# EAGLE schematic Ell-i-proto (EAGLE 6.4)

## Sheet 1 of 3: POE
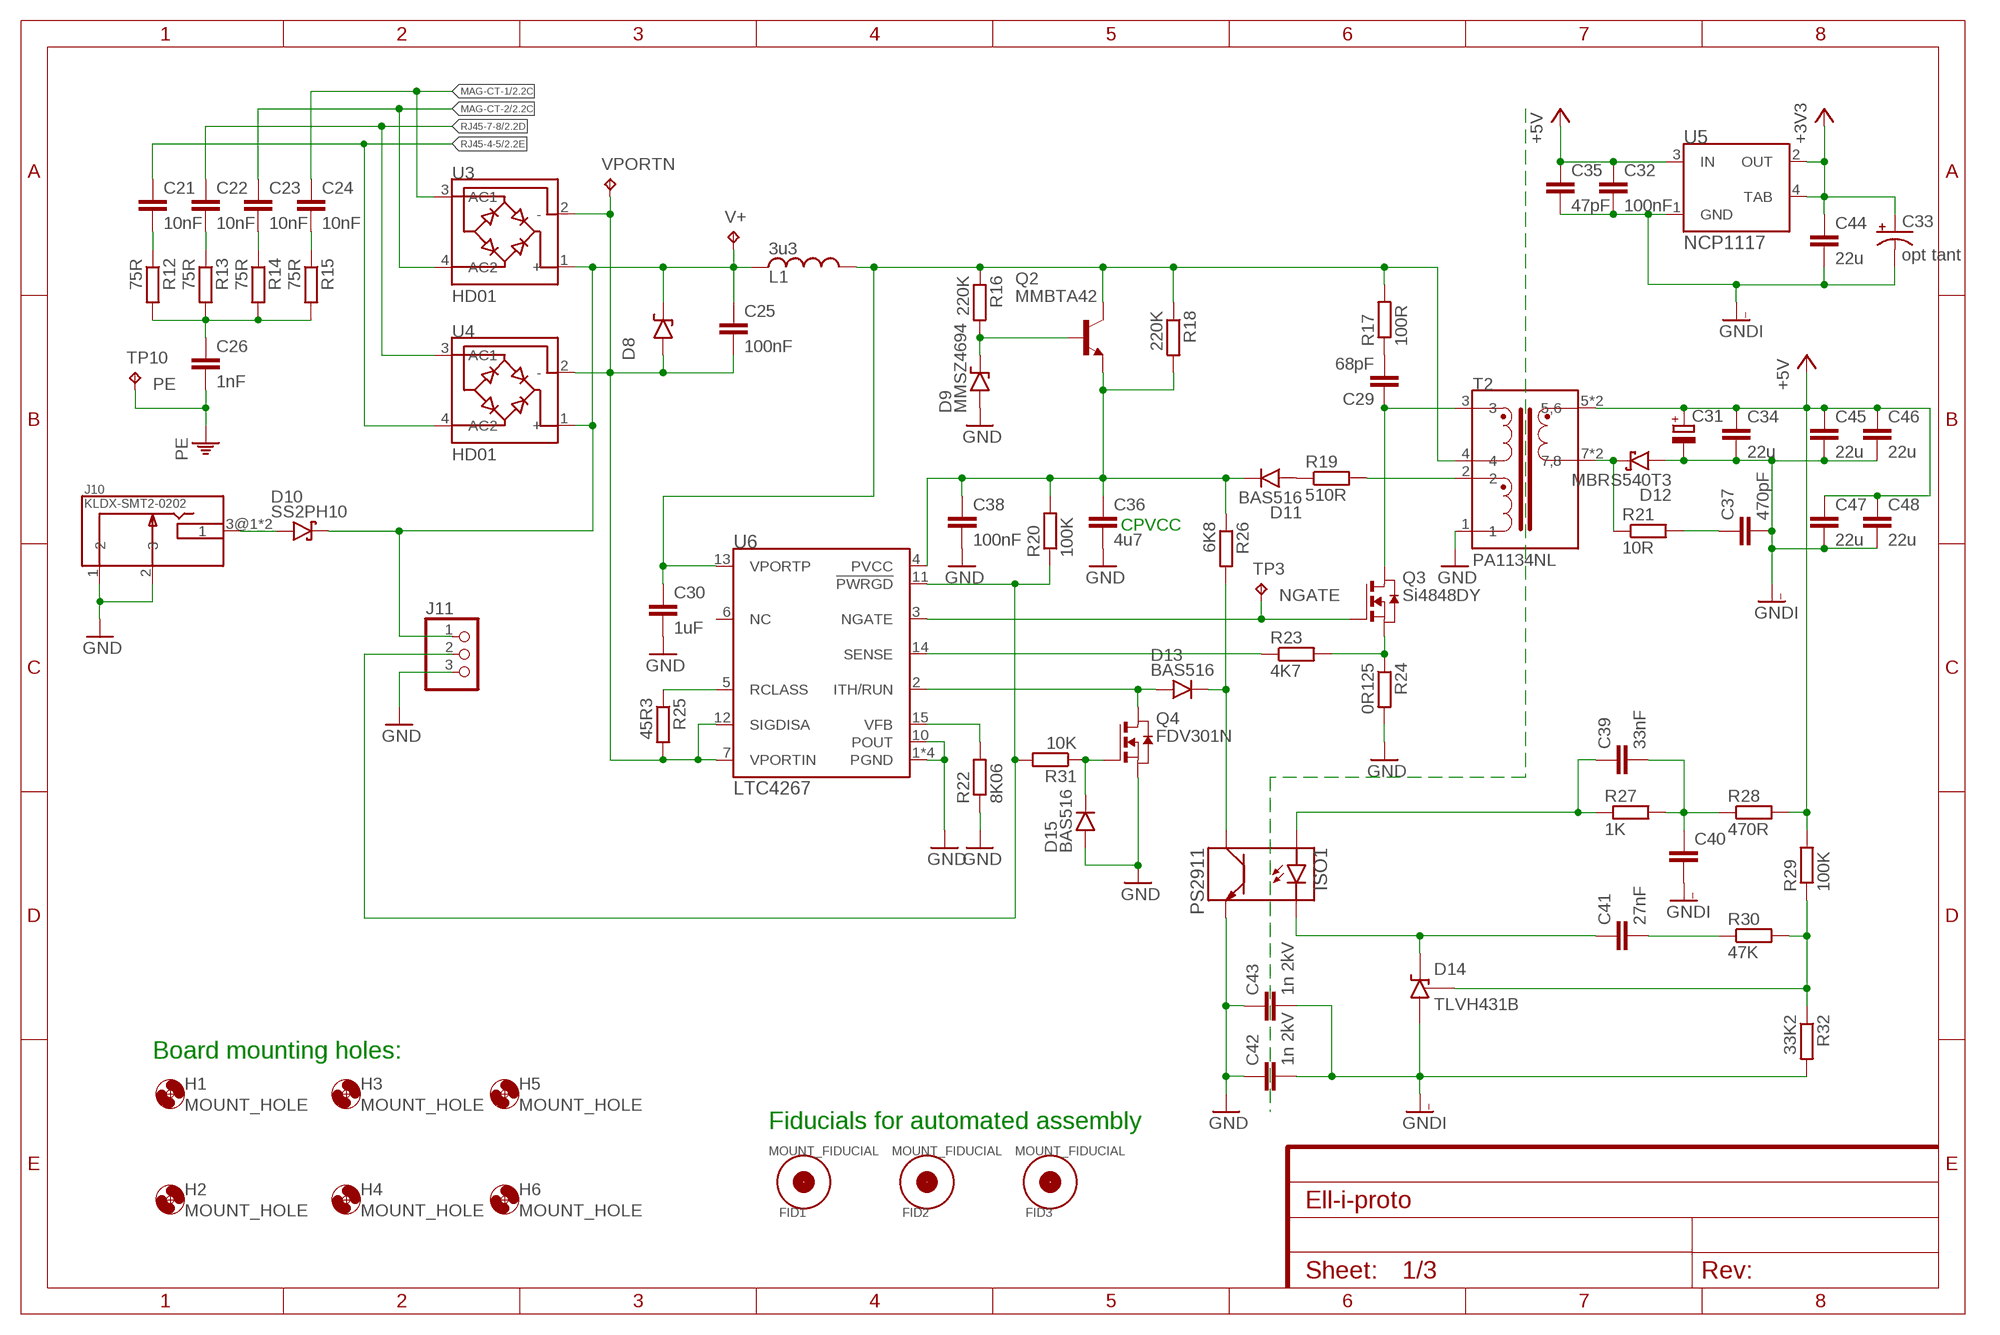
[diagram p0: schematic, sheet 1]

### Parts
C21  10nF  C0603  [0603]
C22  10nF  C0603  [0603]
C23  10nF  C0603  [0603]
C24  10nF  C0603  [0603]
C25  100nF  C0805  [0805]
C26  1nF  C-EUC1206  [C1206]
C29  68pF  C0805  [0805]
C30  1uF  C0805  [0805]
C31  CPOL-EU153CLV-0605  [153CLV-0605]
C32  100nF  C0402  [0402]
C33  opt tant  CPOL-USCT3216  [CT3216]
C34  22u  C0805  [0805]
C35  47pF  C0402  [0402]
C36  4u7  C0805  [0805]
C37  470pF  C0402  [0402]
C38  100nF  C0402  [0402]
C39  33nF  C0402  [0402]
C40  C0402  [0402]
C41  27nF  C0402  [0402]
C42  1n 2kV  C-EUC1206  [C1206]
C43  1n 2kV  C-EUC1206  [C1206]
C44  22u  C0805  [0805]
C45  22u  C0805  [0805]
C46  22u  C0805  [0805]
C47  22u  C0805  [0805]
C48  22u  C0805  [0805]
D8  SMAJ58A  [SMA]
D9  MMSZ4694  ZENER-SOD323-123  [SOD-123]
D10  SS2PH10  [SMP]
D11  BAS516  [SOD523]
D12  MBRS540T3  [SMC]
D13  BAS516  [SOD523]
D14  TLVH431B  TLV431A  [SOT23]
D15  BAS516  [SOD523]
FID1  MOUNT_FIDUCIAL  [MOUNT_FIDUCIAL]
FID2  MOUNT_FIDUCIAL  [MOUNT_FIDUCIAL]
FID3  MOUNT_FIDUCIAL  [MOUNT_FIDUCIAL]
H1  MOUNT_HOLE  [MOUNT_HOLE]
H2  MOUNT_HOLE  [MOUNT_HOLE]
H3  MOUNT_HOLE  [MOUNT_HOLE]
H4  MOUNT_HOLE  [MOUNT_HOLE]
H5  MOUNT_HOLE  [MOUNT_HOLE]
H6  MOUNT_HOLE  [MOUNT_HOLE]
ISO1  PS2911  PS2911-1  [PS2911]
J10  KLDX-SMT2-0202  [KLDX-SMT2-0202]
J11  PINHD-1X3  [1X03]
L1  3u3  MSS5121  [MSS5121]
Q2  MMBTA42  BC846ALT1SMD  [SOT23]
Q3  Si4848DY  SI4848DY  [SO8]
Q4  FDV301N  [SOT23]
R12  75R  R0603  [0603]
R13  75R  R0603  [0603]
R14  75R  R0603  [0603]
R15  75R  R0603  [0603]
R16  220K  R0402  [0402]
R17  100R  R0805  [0805]
R18  220K  R0402  [0402]
R19  510R  R0402  [0402]
R20  100K  R0402  [0402]
R21  10R  R0402  [0402]
R22  8K06  R0402  [0402]
R23  4K7  R0402  [0402]
R24  0R125  R-EU_R1206  [R1206]
R25  45R3  R0402  [0402]
R26  6K8  R0402  [0402]
R27  1K  R0402  [0402]
R28  470R  R0402  [0402]
R29  100K  R0402  [0402]
R30  47K  R0402  [0402]
R31  10K  R0402  [0402]
R32  33K2  R0402  [0402]
T2  PA1134NL  [PA1134NL]
TP3  TPB1,27  [B1,27]
TP10  TPB1,27  [B1,27]
U3  HD01  [MINIDIP4]
U4  HD01  [MINIDIP4]
U5  NCP1117  [SOT223]
U6  LTC4267  LTC4267IGN  [SSOP16]
V+  TPB1,27  [B1,27]
VPORTN  TPB1,27  [B1,27]

### Nets
+3V3 [power]: C33.+ C44.1 U5.2(OUT) U5.4(TAB) ; also sheet 2,3
+5V [power]: C31.+ C32.1 C34.1 C35.1 C45.1 C46.1 C47.1 C48.1 R28.2 R29.2 T2.5(5,6) T2.6(5,6) U5.3(IN) ; also sheet 3
GND [power]: C30.2 C36.2 C38.2 C42.1 C43.1 D9.A D15.2(A) ISO1.3 J10.1 J10.2 J11.3 Q4.2(S) R22.1 R24.2 T2.1 U6.1(PGND) U6.8(PGND) U6.9(PGND) U6.10(POUT) U6.16(PGND)
GNDI [power]: C31.- C32.2 C33.- C34.2 C35.2 C37.2 C40.2 C42.2 C43.2 C44.2 C45.2 C46.2 C47.2 C48.2 D12.2(A) D14.3(A) R32.2 U5.1(GND) ; also sheet 2,3
MAG-CT-1 [power]: C24.1 U3.3(AC1) ; also sheet 2
MAG-CT-2 [power]: C23.1 U3.4(AC2) ; also sheet 2
N22741 [power]: C21.2 R12.1
N22792 [power]: C22.2 R13.1
N22914 [power]: C26.1 R12.2 R13.2 R14.2 R15.2
N23144 [power]: C23.2 R14.1
N23171 [power]: C24.2 R15.1
N27571 [high_voltage]: C29.1 Q3.P$5(D) Q3.P$6(D) Q3.P$7(D) Q3.P$8(D) T2.3
N27735 [high_voltage]: Q3.P$1(S) Q3.P$2(S) Q3.P$3(S) R23.2 R24.1
N28455: R23.1 U6.14(SENSE)
N30165: C36.1 C38.1 D11.1(C) Q2.2(E) R18.2 R20.2 R26.1 U6.4(PVCC)
N30229: D11.2(A) R19.1
N30416: D13.2(A) Q4.3(D) U6.2(ITH/RUN)
N32035: D15.1(C) Q4.1(G) R31.1
N36998: R22.2 U6.15(VFB)
N40108: D14.1(REF) R29.1 R30.2 R32.1
N40137: C41.1 D14.2(C) ISO1.2
N40177: C39.1 ISO1.1 R27.1
N40361: D12.1(C) R21.1 T2.7(7,8) T2.8(7,8)
N40778: C37.1 R21.2
N62909 [power]: C30.1 L1.2 Q2.3(C) R16.1 R17.2 R18.1 T2.4 U6.13(VPORTP)
N62998: D9.C Q2.1(B) R16.2
N64947: R25.1 U6.5(RCLASS)
N68062 [power]: R19.2 T2.2
N68837: C29.2 R17.1
N69576: D13.1(C) ISO1.4 R26.2
N69902: C41.2 R30.1
N70322: C39.2 C40.1 R27.2 R28.1
N184903 [high_power]: D10.A J10.3@1 J10.3@2
NGATE: Q3.P$4(G) TP3.TP U6.3(NGATE)
NPWRGD: J11.2 R20.1 R31.2 U6.11(!PWRGD)
PE [high_voltage]: C26.2 TP10.TP ; also sheet 2
RJ45-4-5 [power]: C21.1 U4.4(AC2) ; also sheet 2
RJ45-7-8 [power]: C22.1 U4.3(AC1) ; also sheet 2
V+ [high_power]: C25.1 D8.1(C) D10.C J11.1 L1.1 U3.1(+) U4.1(+) V+.TP
VPORTN [high_power]: C25.2 D8.2(A) R25.2 U3.2(-) U4.2(-) U6.7(VPORTIN) U6.12(SIGDISA) VPORTN.TP
Unconnected: U6.6(NC)

### Notes on the sheet
- CPVCC
- Board mounting holes:
- Fiducials for automated assembly

## Sheet 2 of 3: Ethernet
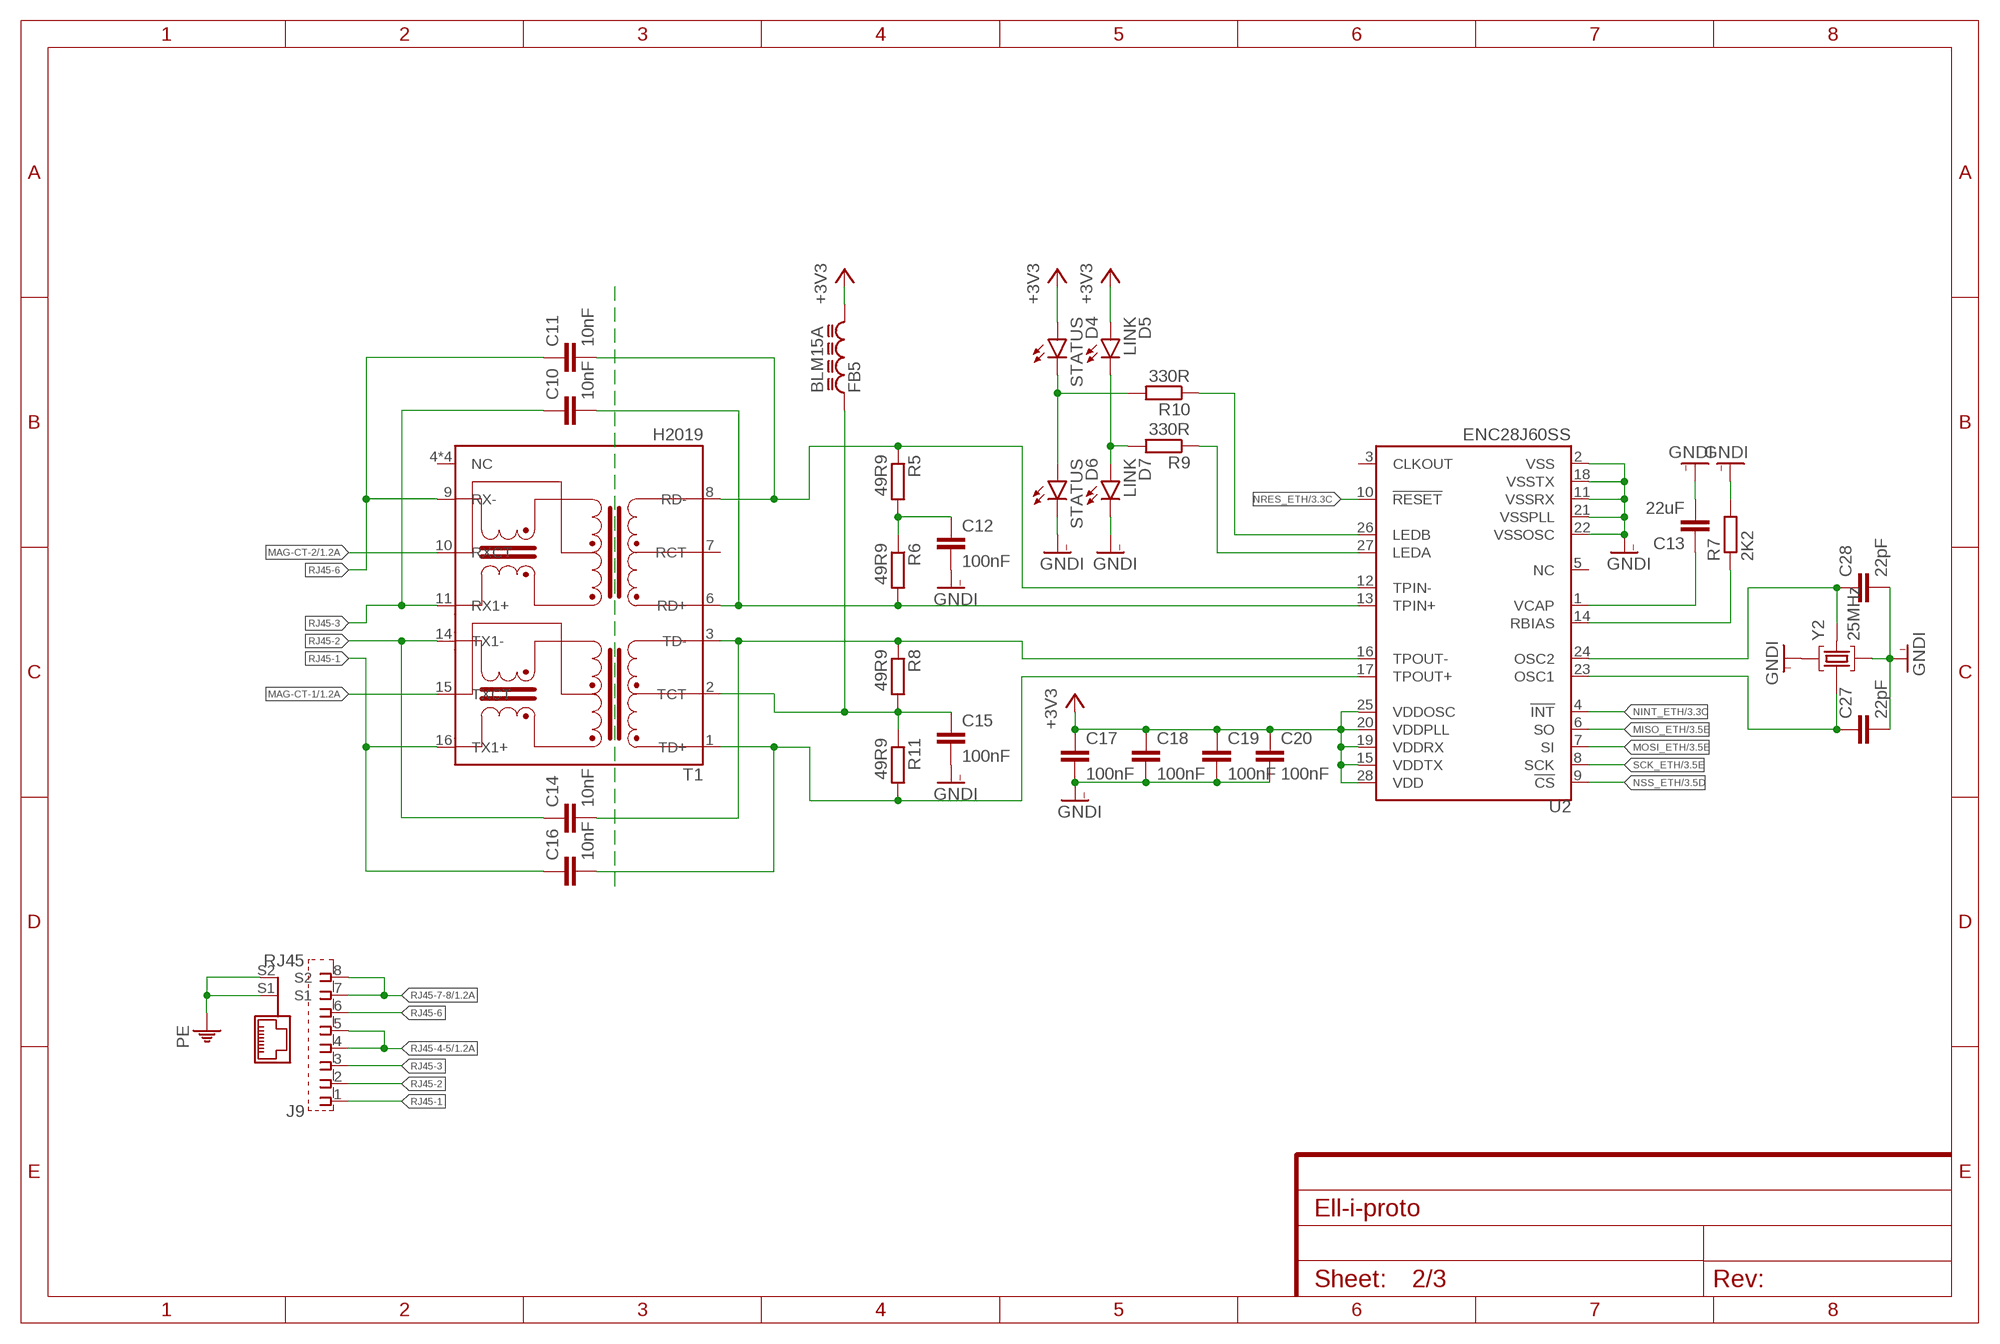
[diagram p1: schematic, sheet 2]

### Parts
C10  10nF  C-EUC1206  [C1206]
C11  10nF  C-EUC1206  [C1206]
C12  100nF  C0402  [0402]
C13  22uF  C0805  [0805]
C14  10nF  C-EUC1206  [C1206]
C15  100nF  C0402  [0402]
C16  10nF  C-EUC1206  [C1206]
C17  100nF  C0402  [0402]
C18  100nF  C0402  [0402]
C19  100nF  C0402  [0402]
C20  100nF  C0402  [0402]
C27  22pF  C0402  [0402]
C28  22pF  C0402  [0402]
D4  STATUS  LED0603  [DIODE0603]
D5  LINK  LED0603  [DIODE0603]
D6  STATUS  LED0603  [DIODE0603]
D7  LINK  LED0603  [DIODE0603]
FB5  BLM15A  LQM15  [0402]
J9  RJ45  85502-5008  [85502-5008]
R5  49R9  R0402  [0402]
R6  49R9  R0402  [0402]
R7  2K2  R0402  [0402]
R8  49R9  R0402  [0402]
R9  330R  R0402  [0402]
R10  330R  R0402  [0402]
R11  49R9  R0402  [0402]
T1  H2019  H2019NL  [H2019NL]
U2  ENC28J60SS  ENC28J60  [SSOP28DB]
Y2  25MHz  XTAL3225  [XTAL3225]

### Nets
+3V3 [power]: C17.1 C18.1 C19.1 C20.1 D4.2(A) D5.2(A) FB5.2 U2.15(VDDTX) U2.19(VDDRX) U2.20(VDDPLL) U2.25(VDDOSC) U2.28(VDD) ; also sheet 1,3
GNDI [power]: C12.2 C13.2 C15.2 C17.2 C18.2 C19.2 C20.2 C27.2 C28.2 D6.1(C) D7.1(C) R7.2 U2.2(VSS) U2.11(VSSRX) U2.18(VSSTX) U2.21(VSSPLL) U2.22(VSSOSC) Y2.2(GND) Y2.4(GND) ; also sheet 1,3
MAG-CT-1 [power]: T1.15(TXCT) ; also sheet 1
MAG-CT-2 [power]: T1.10(RXCT) ; also sheet 1
MISO_ETH: U2.6(SO) ; also sheet 3
MOSI_ETH: U2.7(SI) ; also sheet 3
N08557: C14.2 R8.1 T1.3(TD-) U2.16(TPOUT-)
N08738: C16.2 R11.2 T1.1(TD+) U2.17(TPOUT+)
N08782: C10.2 R6.2 T1.6(RD+) U2.13(TPIN+)
N08928: C11.2 R5.1 T1.8(RD-) U2.12(TPIN-)
N12266: C15.1 FB5.1 R8.2 R11.1 T1.2(TCT)
N12583: R7.1 U2.14(RBIAS)
N13468: C28.1 U2.24(OSC2) Y2.3(C2)
N13660: C27.1 U2.23(OSC1) Y2.1(C1)
N14101: C13.1 U2.1(VCAP)
N16078: C12.1 R5.2 R6.1
N181699: R9.1 U2.27(LEDA)
N181770: R10.1 U2.26(LEDB)
N182309: D4.1(C) D6.2(A) R10.2
N$1: D5.1(C) D7.2(A) R9.2
NINT_ETH: U2.4(!INT) ; also sheet 3
NRES_ETH: U2.10(!RESET) ; also sheet 3
NSS_ETH: U2.9(!CS) ; also sheet 3
PE [high_voltage]: J9.S1 J9.S2 ; also sheet 1
RJ45-1: C16.1 J9.1 T1.16(TX1+)
RJ45-2: C14.1 J9.2 T1.14(TX1-)
RJ45-3: C10.1 J9.3 T1.11(RX1+)
RJ45-4-5 [power]: J9.4 J9.5 ; also sheet 1
RJ45-6: C11.1 J9.6 T1.9(RX-)
RJ45-7-8 [power]: J9.7 J9.8 ; also sheet 1
SCK_ETH: U2.8(SCK) ; also sheet 3
Unconnected: T1.4(NC) T1.5(NC) T1.7(RCT) T1.12(NC) T1.13(NC) U2.3(CLKOUT) U2.5(NC)

## Sheet 3 of 3: CPU
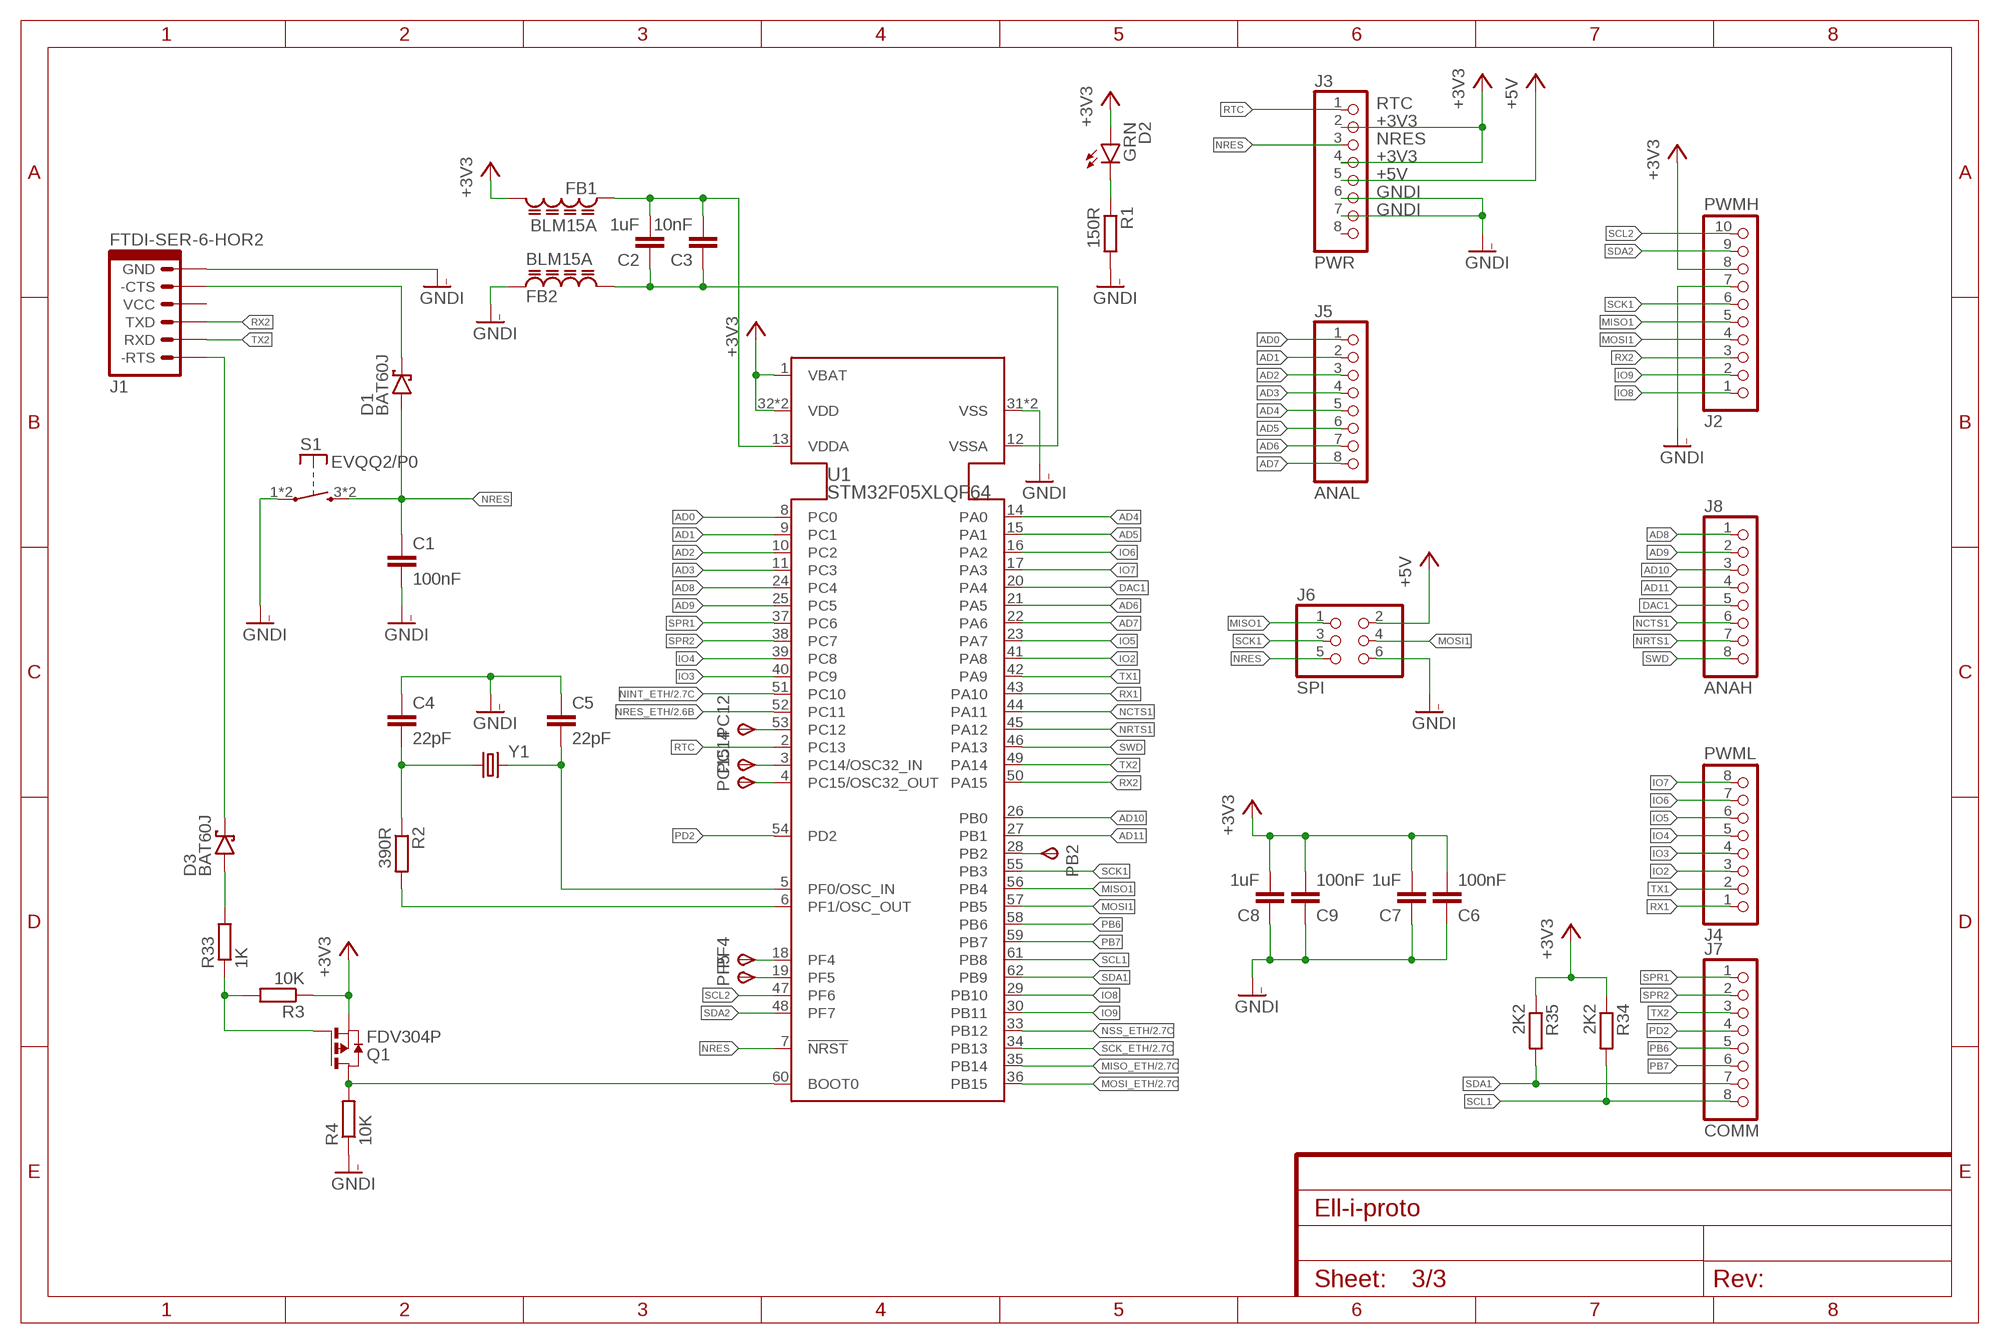
[diagram p2: schematic, sheet 3]

### Parts
C1  100nF  C0402  [0402]
C2  1uF  C0402  [0402]
C3  10nF  C0402  [0402]
C4  22pF  C0402  [0402]
C5  22pF  C0402  [0402]
C6  100nF  C0402  [0402]
C7  1uF  C0402  [0402]
C8  1uF  C0402  [0402]
C9  100nF  C0402  [0402]
D1  BAT60J  [SOD323_DIODE]
D2  GRN  LED0603  [DIODE0603]
D3  BAT60J  [SOD323_DIODE]
FB1  BLM15A  LQM15  [0402]
FB2  BLM15A  LQM15  [0402]
J1  FTDI-SER-6-HOR2  [TSM-106-01-L-SH-REV]
J2  PWMH  PINHD-1X10  [1X10]
J3  PWR  PINHD-1X8  [1X08]
J4  PWML  PINHD-1X8  [1X08]
J5  ANAL  PINHD-1X8  [1X08]
J6  SPI  PINHD-2X3  [2X03]
J7  COMM  PINHD-1X8  [1X08]
J8  ANAH  PINHD-1X8  [1X08]
PB2  TPSB1,27  [B1,27]
PC12  TPSB1,27  [B1,27]
PC14  TPSB1,27  [B1,27]
PC15  TPSB1,27  [B1,27]
PF4  TPSB1,27  [B1,27]
PF5  TPSB1,27  [B1,27]
Q1  FDV304P  [SOT23]
R1  150R  R0402  [0402]
R2  390R  R0402  [0402]
R3  10K  R0402  [0402]
R4  10K  R0402  [0402]
R33  1K  R0402  [0402]
R34  2K2  R0402  [0402]
R35  2K2  R0402  [0402]
S1  EVQQ2/P0  [EVQQ2/P0]
U1  STM32F05XLQF64  STM32F051RX  [LQFP64]
Y1  CRYSTALSM49  [SM49]

### Nets
+3V3 [power]: C6.2 C7.2 C8.2 C9.2 D2.2(A) FB1.2 J2.8 J3.2 J3.4 Q1.2(S) R3.1 R34.1 R35.1 U1.1(VBAT) U1.32(VDD) U1.64(VDD) ; also sheet 1,2
+5V [power]: J3.5 J6.2 ; also sheet 1
AD0: J5.1 U1.8(PC0)
AD1: J5.2 U1.9(PC1)
AD2: J5.3 U1.10(PC2)
AD3: J5.4 U1.11(PC3)
AD4: J5.5 U1.14(PA0)
AD5: J5.6 U1.15(PA1)
AD6: J5.7 U1.21(PA5)
AD7: J5.8 U1.22(PA6)
AD8: J8.1 U1.24(PC4)
AD9: J8.2 U1.25(PC5)
AD10: J8.3 U1.26(PB0)
AD11: J8.4 U1.27(PB1)
DAC1: J8.5 U1.20(PA4)
GNDI [power]: C1.2 C4.1 C5.1 C6.1 C7.1 C8.1 C9.1 FB2.1 J1.1(GND) J2.7 J3.6 J3.7 J6.6 R1.2 R4.1 S1.1(P) S1.2(P) U1.31(VSS) U1.63(VSS) ; also sheet 1,2
IO2: J4.3 U1.41(PA8)
IO3: J4.4 U1.40(PC9)
IO4: J4.5 U1.39(PC8)
IO5: J4.6 U1.23(PA7)
IO6: J4.7 U1.16(PA2)
IO7: J4.8 U1.17(PA3)
IO8: J2.1 U1.29(PB10)
IO9: J2.2 U1.30(PB11)
MISO1: J2.5 J6.1 U1.56(PB4)
MISO_ETH: U1.35(PB14) ; also sheet 2
MOSI1: J2.4 J6.4 U1.57(PB5)
MOSI_ETH: U1.36(PB15) ; also sheet 2
N41567: D2.1(C) R1.1
N98218: C2.1 C3.1 FB2.2 U1.12(VSSA)
N100630: C2.2 C3.2 FB1.1 U1.13(VDDA)
N118561: Q1.3(D) R4.2 U1.60(BOOT0)
N205481: C4.2 R2.1 Y1.1
N209164: Q1.1(G) R3.2 R33.1
N230488: D3.2(A) R33.2
N$2: PC14.TP(PP) U1.3(PC14/OSC32_IN)
N$3: PC15.TP(PP) U1.4(PC15/OSC32_OUT)
N$5: PF4.TP(PP) U1.18(PF4)
N$6: D1.1(C) J1.2(-CTS)
N$7: PF5.TP(PP) U1.19(PF5)
N$8: PB2.TP(PP) U1.28(PB2)
N$9: PC12.TP(PP) U1.53(PC12)
NCTS1: J8.6 U1.44(PA11)
NDSR2: D3.1(C) J1.6(-RTS)
NINT_ETH: U1.51(PC10) ; also sheet 2
NRES: C1.1 D1.2(A) J3.3 J6.5 S1.3(S) S1.4(S) U1.7(!NRST)
NRES_ETH: U1.52(PC11) ; also sheet 2
NRTS1: J8.7 U1.45(PA12)
NSS_ETH: U1.33(PB12) ; also sheet 2
PB6: J7.5 U1.58(PB6)
PB7: J7.6 U1.59(PB7)
PD2: J7.4 U1.54(PD2)
PF0: C5.2 U1.5(PF0/OSC_IN) Y1.2
PF1: R2.2 U1.6(PF1/OSC_OUT)
RTC: J3.1 U1.2(PC13)
RX1: J4.1 U1.43(PA10)
RX2: J1.4(TXD) J2.3 U1.50(PA15)
SCK1: J2.6 J6.3 U1.55(PB3)
SCK_ETH: U1.34(PB13) ; also sheet 2
SCL1: J7.8 R34.2 U1.61(PB8)
SCL2: J2.10 U1.47(PF6)
SDA1: J7.7 R35.2 U1.62(PB9)
SDA2: J2.9 U1.48(PF7)
SPR1: J7.1 U1.37(PC6)
SPR2: J7.2 U1.38(PC7)
SWD: J8.8 U1.46(PA13)
TX1: J4.2 U1.42(PA9)
TX2: J1.5(RXD) J7.3 U1.49(PA14)
Unconnected: J1.3(VCC) J3.8

## Library data of the parts
C1-C9 C12 C13 C15 C17-C25 C27-C30 C32 C34-C41 C44-C48 = ell-i:C
C10 C11 C14 C16 C26 C42 C43 = rcl:C-EU: CAPACITOR, European symbol
C31 = rcl:CPOL-EU: POLARIZED CAPACITOR, European symbol
C33 = rcl:CPOL-US: POLARIZED CAPACITOR, American symbol
D1 D3 = ell-i:BAT60J
D2 D4-D7 = ell-i:LED0603
D8 = ell-i:SMAJ58A
D9 = ell-i:ZENER-SOD323
D10 = ell-i:SS2PH10
D11 D13 D15 = ell-i:BAS516
D12 = ell-i:MBRS540T3
D14 = ell-i:TLV431A
FB1 FB2 FB5 = ell-i:LQM15
FID1-FID3 = ell-i:MOUNT_FIDUCIAL
H1-H6 = ell-i:MOUNT_HOLE
ISO1 = ell-i:PS2911-1
J1 = ell-i:FTDI-SER-6
J2 = ell-i:PINHD-1X10: PIN HEADER
J3-J5 J7 J8 = ell-i:PINHD-1X8: PIN HEADER
J6 = ell-i:PINHD-2X3: PIN HEADER
J9 = ell-i:85502-5008
J10 = ell-i:KLDX-SMT2-0202
J11 = pinhead:PINHD-1X3: PIN HEADER
L1 = ell-i:MSS5121
PB2 PC12 PC14 PC15 PF4 PF5 = testpad:TPS: TEST PIN
Q1 = ell-i:FDV304P
Q2 = transistor-npn:BC846*: NPN Transistor
Q3 = ell-i:SI4848DY
Q4 = ell-i:FDV301N
R1-R23 R25-R35 = ell-i:R
R24 = rcl:R-EU_: RESISTOR, European symbol
S1 = ell-i:EVQQ2/P0
T1 = ell-i:H2019NL
T2 = ell-i:PA1134NL
TP3 TP10 V+ VPORTN = testpad:TP: Test pad
U1 = ell-i:STM32F051RX
U2 = ell-i:ENC28J60
U3 U4 = ell-i:HD01
U5 = ell-i:NCP1117
U6 = ell-i:LTC4267
Y1 = crystal:CRYSTAL: CRYSTAL; OC_FARNELL: unknown; OC_NEWARK: unknown
Y2 = ell-i:XTAL3225

## Net classes
0 default: width 0.1 mm, drill 0.3 mm, clearance 0.1 mm
1 power: width 0.3 mm, drill 0.3 mm, clearance 0.15 mm
2 high_voltage: width 0.15 mm, drill 0.3 mm, clearance 0.5 mm
3 high_power: width 0.5 mm, drill 0.3 mm, clearance 0.15 mm